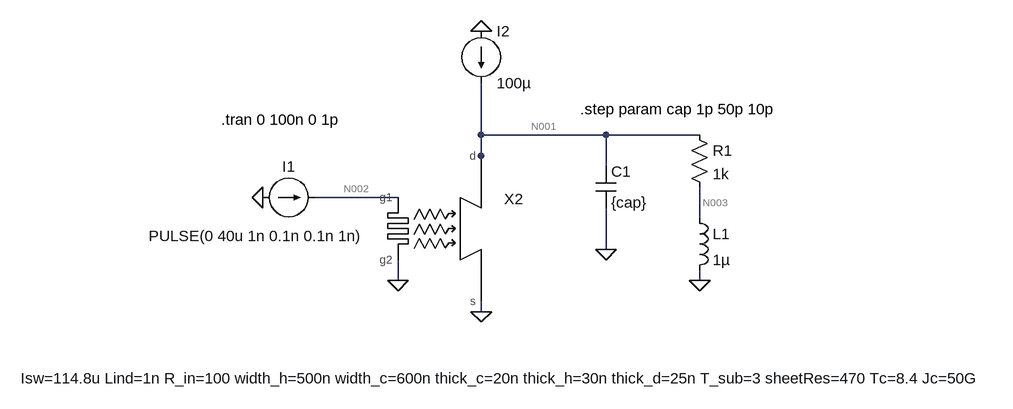
[diagram p0: schematic hTron_LRC.asc]
hTron_LRC.asc, the LTspice schematic file:
Version 4
SHEET 1 1196 680
WIRE 288 16 288 -64
WIRE 480 16 288 16
WIRE 624 16 480 16
WIRE 288 48 288 16
WIRE 288 64 288 48
WIRE 480 64 480 16
WIRE 160 112 32 112
WIRE 624 144 624 96
WIRE 480 192 480 128
WIRE 160 240 160 208
WIRE 624 240 624 224
WIRE 288 288 288 272
FLAG -48 112 0
FLAG 288 -144 0
FLAG 160 240 0
FLAG 288 288 0
FLAG 480 192 0
FLAG 624 240 0
SYMBOL current -48 112 R270
WINDOW 0 32 40 VTop 2
WINDOW 3 -44 -10 VBottom 2
WINDOW 123 0 0 Left 0
WINDOW 39 0 0 Left 0
SYMATTR InstName I1
SYMATTR Value PULSE(0 40u 1n 0.1n 0.1n 1n)
SYMBOL current 288 -144 R0
WINDOW 123 0 0 Left 0
WINDOW 39 0 0 Left 0
SYMATTR InstName I2
SYMATTR Value 100µ
SYMBOL res 608 0 R0
SYMATTR InstName R1
SYMATTR Value 1k
SYMBOL cap 464 64 R0
SYMATTR InstName C1
SYMATTR Value {cap}
SYMBOL ind 608 128 R0
SYMATTR InstName L1
SYMATTR Value 1µ
SYMBOL hTron_debug 288 160 R0
WINDOW 39 39 246 Bottom 2
SYMATTR SpiceLine Isw=114.8u Lind=1n R_in=100 width_h=500n width_c=600n thick_c=20n thick_h=30n thick_d=25n T_sub=3 sheetRes=470 Tc=8.4 Jc=50G
SYMATTR InstName X2
TEXT 440 -24 Left 2 !.step param cap 1p 50p 10p
TEXT -112 -8 Left 2 !.tran 0 100n 0 1p

The netlist it stands for:
* hTron_LRC.asc
I1 0 N002 PULSE(0 40u 1n 0.1n 0.1n 1n)
I2 0 N001 100µ
R1 N001 N003 1k
C1 N001 0 {cap}
L1 N003 0 1µ
XX2 N001 N002 0 0 hTron_debug params: hTron_debug Isw=114.8u Lind=1n R_in=100 width_h=500n width_c=600n thick_c=20n thick_h=30n thick_d=25n T_sub=3 sheetRes=470 Tc=8.4 Jc=50G  ; pins d g1 g2 s
.step param cap 1p 50p 10p
.tran 0 100n 0 1p
.backanno
.end

* Results of the author's LTspice run, read from the files saved beside the schematic
* Operating Point (first step), zero values left out:
*   cap = 1 p
*   I(I2) = 100 µA
*   Ix(x2:D) = 100 µA
*   Ix(x2:S) = -100 µA
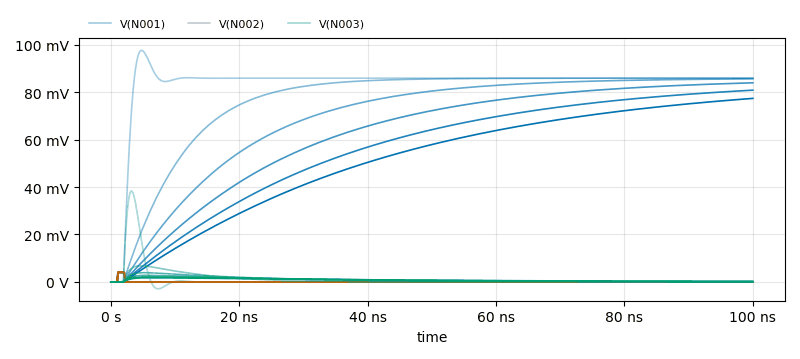
[diagram p1: Transient Analysis of hTron_LRC.asc, plotted from the saved traces]
* Transient Analysis, 6 runs:
*   V(N001) [cap=1e-012]: min 0 V, max 97.61 mV, average 83.83 mV, rms 84.86 mV, last 85.89 mV
*   V(N001) [cap=1.1e-011]: min 0 V, max 85.89 mV, average 76.4 mV, rms 78.99 mV, last 85.89 mV
*   V(N001) [cap=2.1e-011]: min 0 V, max 85.6 mV, average 69.02 mV, rms 72.75 mV, last 85.6 mV
*   V(N001) [cap=3.1e-011]: min 0 V, max 83.93 mV, average 62.05 mV, rms 66.45 mV, last 83.93 mV
*   V(N001) [cap=4.1e-011]: min 0 V, max 80.83 mV, average 55.86 mV, rms 60.57 mV, last 80.83 mV
*   V(N001) [cap=5e-011]: min 0 V, max 77.36 mV, average 51.03 mV, rms 55.83 mV, last 77.36 mV
*   V(N002) [cap=1e-012]: min 0 V, max 4 mV, average 44 µV, rms 416.5 µV, last 0 V
*   V(N002) [cap=1.1e-011]: min 0 V, max 4 mV, average 44 µV, rms 416.6 µV, last 0 V
*   V(N002) [cap=2.1e-011]: min 0 V, max 4 mV, average 44 µV, rms 416.4 µV, last 0 V
*   V(N002) [cap=3.1e-011]: min 0 V, max 4 mV, average 44 µV, rms 416.4 µV, last 0 V
*   V(N002) [cap=4.1e-011]: min 0 V, max 4 mV, average 44 µV, rms 416.5 µV, last 0 V
*   V(N002) [cap=5e-011]: min 0 V, max 4 mV, average 44 µV, rms 416.6 µV, last 0 V
*   V(N003) [cap=1e-012]: min -2.902 mV, max 38.3 mV, average 858.3 µV, rms 5.139 mV, last 85.66 nV
*   V(N003) [cap=1.1e-011]: min 0 V, max 6.797 mV, average 858.9 µV, rms 1.898 mV, last 205.6 nV
*   V(N003) [cap=2.1e-011]: min 0 V, max 3.885 mV, average 855.7 µV, rms 1.395 mV, last 18.26 µV
*   V(N003) [cap=3.1e-011]: min 0 V, max 2.732 mV, average 838.4 µV, rms 1.154 mV, last 79.39 µV
*   V(N003) [cap=4.1e-011]: min 0 V, max 2.118 mV, average 806.7 µV, rms 1.005 mV, last 151.9 µV
*   V(N003) [cap=5e-011]: min 0 V, max 1.762 mV, average 771.5 µV, rms 908.9 µV, last 207.7 µV